# Altium schematic sheet S52最小系统.SchDoc
size A4
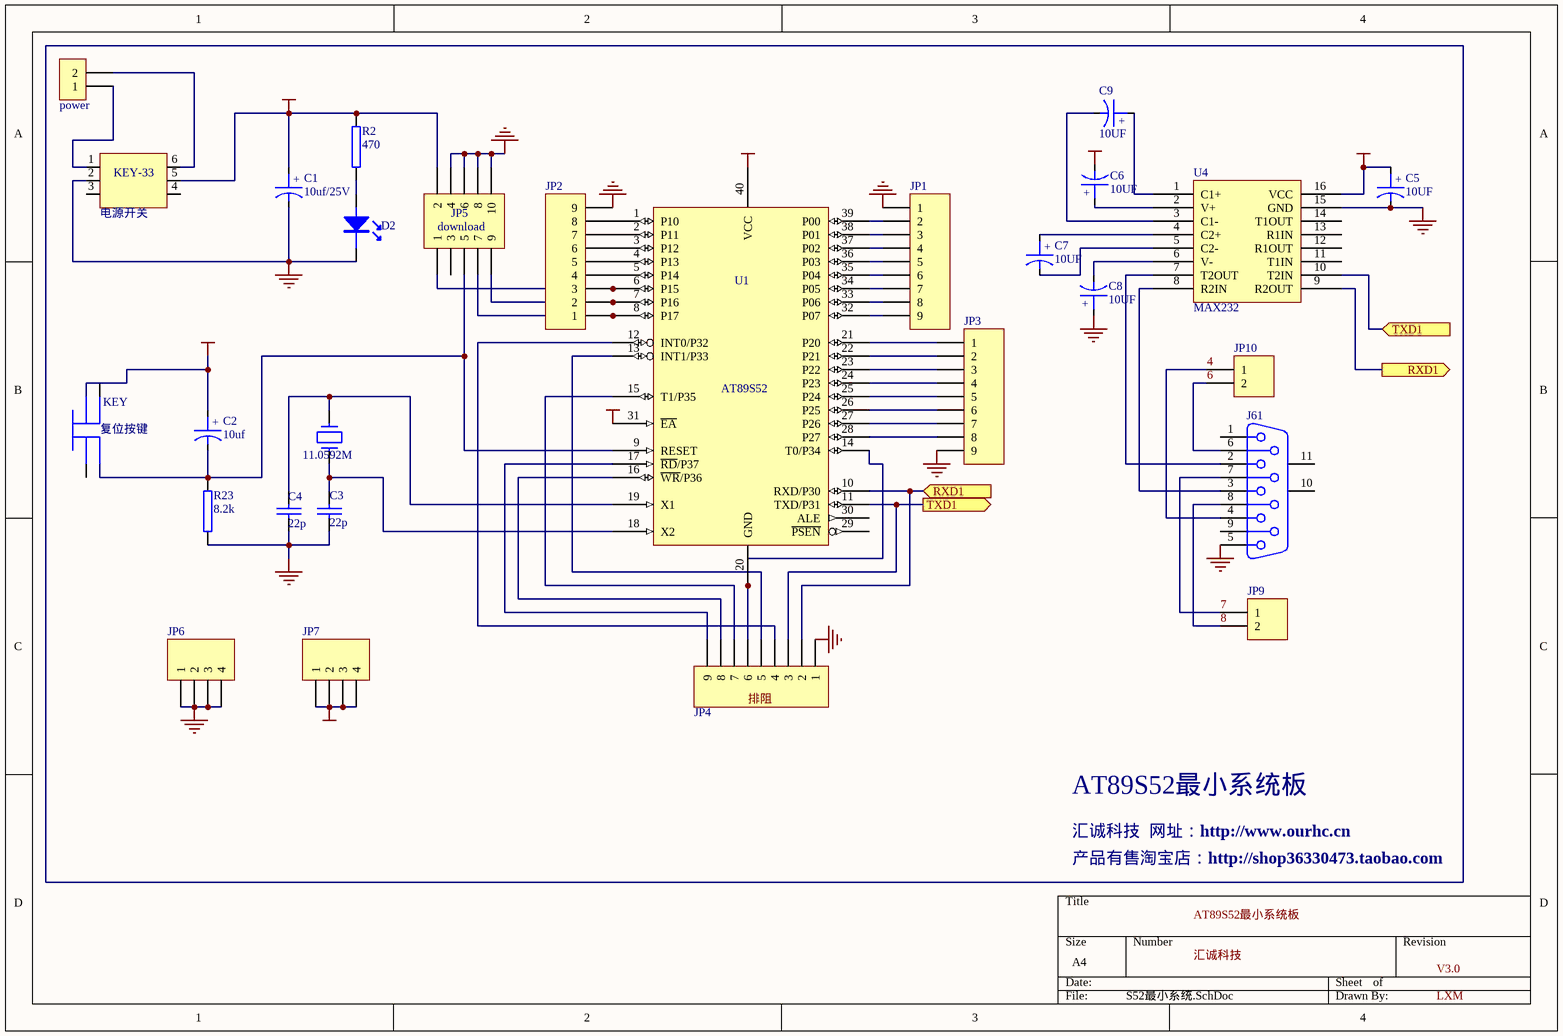
[diagram p0: S52最小系统.SchDoc]

## Parts
11  power  [power1]
C1  10uf/25V  [cap2]
C2  10uf  [cap2]
C3  22p  [RAD0.3]
C4  22p  [RAD0.3]
C5  10UF  [cap2]
C6  10UF  [cap2]
C7  10UF  [cap2]
C8  10UF  [cap2]
C9  10UF  [cap2]
D2  LED  [LED]  (value not drawn)
J61  D Connector 9  [DSUB1.385-2H9]  (value not drawn)
JP1  (no value)  [HDR1X9]
JP2  (no value)  [HDR1X9]
JP3  (no value)  [HDR1X9]
JP4  (no value)  [HDR1X9]
JP5  download  [HDR2X5]
JP6  (no value)  [HDR1X4]
JP7  (no value)  [HDR1X4]
JP9  (no value)  [HDR1X2]
JP10  Header 3  [HDR1X2]  (value not drawn)
KEY  复位按键  [KEY-1]
KEY-33  电源开关  [KEY-2]
R2  470  [AXIAL0.4]
R23  8.2k  [AXIAL0.4]
U1  AT89S52  [AT89S52Pid]
U4  MAX232  [DIP16]
Y  11.0592M  [CRYSTAL]

## Ports
RXD1 (in), RXD1 (out), TXD1 (in), TXD1 (out)

## Nets
GND: C1.2 C3.2 C4.2 C5.2 C8.1 D2.2(K) J61.5 JP1.1 JP2.9 JP3.9 JP4.1 JP5.4 JP5.6 JP5.8 JP5.10 JP6.1 JP6.2 JP6.3 JP6.4 KEY-33.2 R23.2 U4.15(GND)
VCC: C1.1 C2.1 C5.1 C6.2 JP5.2 JP7.1 JP7.2 JP7.3 JP7.4 KEY.1 KEY-33.5 R2.1 U1.31(~{EA}) U1.40(VCC) U4.16(VCC)
4: J61.4 JP10.1
6: J61.6 JP10.2
7: J61.7 JP9.1
8: J61.8 JP9.2
RXD1: JP4.2 U1.10(RXD/P30) U4.9(R2OUT) ; port RXD1
TXD1: JP4.3 U1.11(TXD/P31) U4.10(T2IN) ; port TXD1
Net11_1: 11.1 KEY-33.1
Net11_2: 11.2 KEY-33.6
NetC2_2: C2.2 JP5.5 KEY.2 R23.1 U1.9(RESET)
NetC3_1: C3.1 U1.18(X2) Y.2
NetC4_1: C4.1 U1.19(X1) Y.1
NetC6_1: C6.1 U4.2(V+)
NetC7_1: C7.1 U4.4(C2+)
NetC7_2: C7.2 U4.5(C2-)
NetC8_2: C8.2 U4.6(V-)
NetC9_1: C9.1 U4.1(C1+)
NetC9_2: C9.2 U4.3(C1-)
NetD2_1: D2.1(A) R2.2
NetJ61_2: J61.2 U4.7(T2OUT)
NetJ61_3: J61.3 U4.8(R2IN)
NetJP1_2: JP1.2 U1.39(P00)
NetJP1_3: JP1.3 U1.38(P01)
NetJP1_4: JP1.4 U1.37(P02)
NetJP1_5: JP1.5 U1.36(P03)
NetJP1_6: JP1.6 U1.35(P04)
NetJP1_7: JP1.7 U1.34(P05)
NetJP1_8: JP1.8 U1.33(P06)
NetJP1_9: JP1.9 U1.32(P07)
NetJP2_1: JP2.1 JP5.7 U1.8(P17)
NetJP2_2: JP2.2 JP5.9 U1.7(P16)
NetJP2_3: JP2.3 JP5.1 U1.6(P15)
NetJP2_4: JP2.4 U1.5(P14)
NetJP2_5: JP2.5 U1.4(P13)
NetJP2_6: JP2.6 U1.3(P12)
NetJP2_7: JP2.7 U1.2(P11)
NetJP2_8: JP2.8 U1.1(P10)
NetJP3_1: JP3.1 U1.21(P20)
NetJP3_2: JP3.2 U1.22(P21)
NetJP3_3: JP3.3 U1.23(P22)
NetJP3_4: JP3.4 U1.24(P23)
NetJP3_5: JP3.5 U1.25(P24)
NetJP3_6: JP3.6 U1.26(P25)
NetJP3_7: JP3.7 U1.27(P26)
NetJP3_8: JP3.8 U1.28(P27)
NetJP4_4: JP4.4 U1.12(INT0/P32)
NetJP4_5: JP4.5 U1.13(INT1/P33)
NetJP4_6: JP4.6 U1.14(T0/P34) U1.20(GND)
NetJP4_7: JP4.7 U1.15(T1/P35)
NetJP4_8: JP4.8 U1.16(~{WR}/P36)
NetJP4_9: JP4.9 U1.17(~{RD}/P37)

Not connected (* = marked no-connect by the designer): J61 1 9 10(MH1) 11(MH2); JP5 3; KEY 0 3; KEY-33 3 4; U1 29(~{PSEN}) 30(ALE); U4 11(T1IN) 12(R1OUT) 13(R1IN) 14(T1OUT)

## Notes on the sheet
- AT89S52最小系统板
- 汇诚科技  网址：http://www.ourhc.cn
- 产品有售淘宝店：http://shop36330473.taobao.com
- Labels drawn without touching a wire or pin: AT89S52最小系统板, LXM, V3.0, 排阻, 汇诚科技
- (in symbol CAPACITOR POL) +

## Library data of the parts
C1 C2 C5-C9 = CAPACITOR POL: Capacitor
C3 C4 = CAP: Capacitor
J61 = D Connector 9: Receptacle Assembly, 9 Position, Right Angle; Package Information: Latest Revision: O; Positions: 9; Published: 15-Jun-2001; Revision: 17-Jul-2002: Re-released for DXP Platform.; Datasheet: (1-Sep-1999); Package Reference: 788750; Publisher: Altium Limited; Orientation: Right Angle; Gender: Receptacle
JP1-JP4 = Header 9: Header, 9-Pin; Revision: 17-Jul-2002: Re-released for DXP Platform.; Publisher: Altium Limited
JP5 = Header 5X2: Header, 5-Pin, Dual row; Revision: 17-Jul-2002: Re-released for DXP Platform.; Publisher: Altium Limited
JP6 JP7 = Header 4: Header, 4-Pin; Revision: 17-Jul-2002: Re-released for DXP Platform.; Publisher: Altium Limited
JP9 JP10 = Header 2: Header, 2-Pin; Revision: 17-Jul-2002: Re-released for DXP Platform.; Publisher: Altium Limited
KEY = KEY
KEY-33 = KEY-33
R2 R23 = RES2
U1 = 8051
Y = CRYSTAL